# EAGLE design I2C_2_USB (EAGLE 7.7.0)
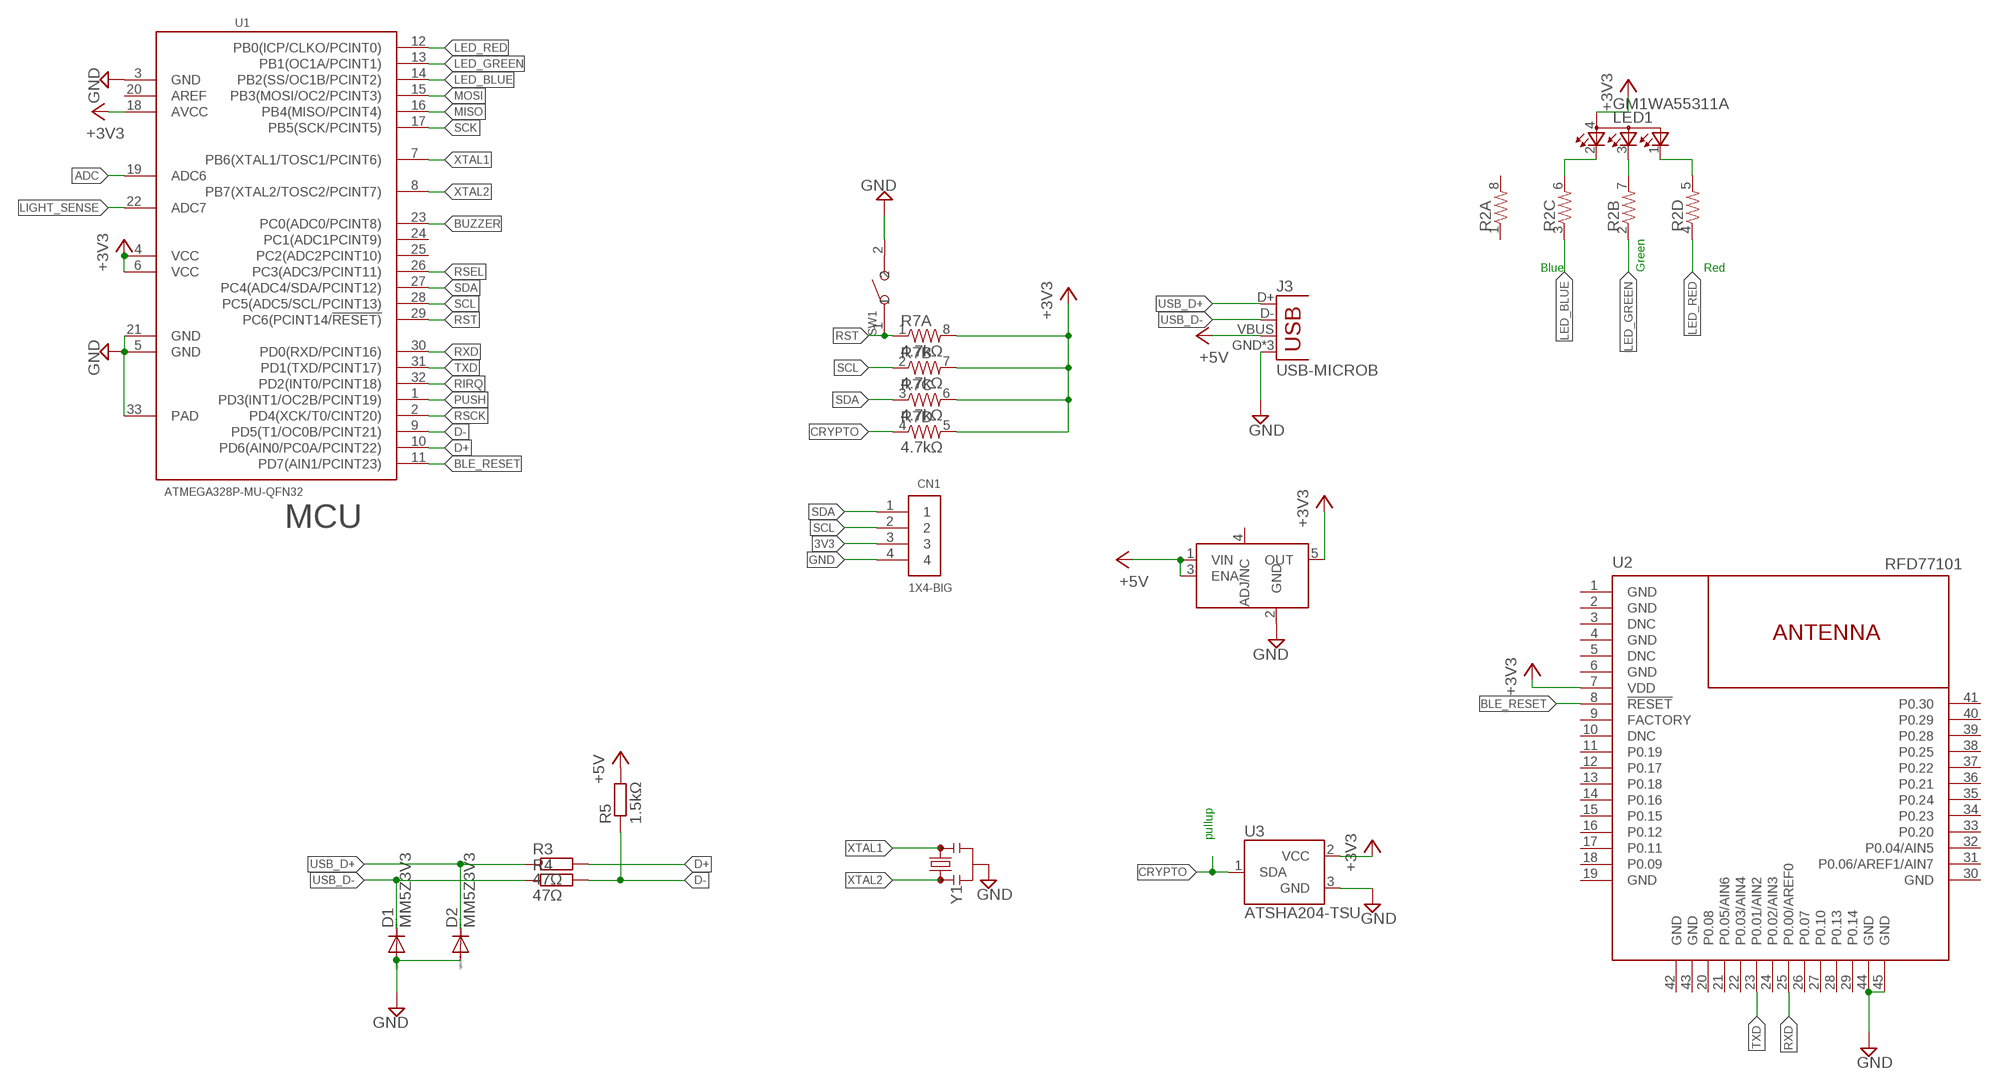
[diagram p0: schematic, sheet 1]

## Parts
CN1  1X4-BIG  [1X04-BIG]
D1  MM5Z3V3  DIODE-SOD523  [SOD523]
D2  MM5Z3V3  DIODE-SOD523  [SOD523]
J3  USB-MICROB  [USB-MICROB]
LED1  GM1WA55311A  [GM1WA55311A]
R2  RESISTOR-ARRAY0603-ARV  [0603-ARV]
R3  47Ω  R-EU_R0603  [R0603]
R4  47Ω  R-EU_R0603  [R0603]
R5  1.5kΩ  R-EU_R0603  [R0603]
R7  4.7kΩ  RESISTOR-ARRAY0603-ARV  [0603-ARV]
SW1  SMD-BUTTON(2P-6.0X3.0X2.5MM)-DHT-1163S  [SW2-4.0-6.0X3.0X2.5MM]
U1  ATMEGA328P-MU-QFN32  MCU-ATMEGA328P-MU(QFN32)  [QFN32G-0.5-5X5MM]
U2  RFD77101  [RFD77101]
U3  ATSHA204-TSU  [SOT23-3]
U$4  LDCL015  [SOT23-5]
Y1  RESONATORSMD-3.2X1.3  [RESONATOR-SMD-3.2X1.3]

## Nets
3V3: CN1.3
+3V3: LED1.4(A) R7.5 R7.6 R7.7 R7.8 U1.4(VCC) U1.6(VCC) U1.18(AVCC) U2.7(VDD) U3.2(VCC) U$4.5(OUT)
+5V: J3.VBUS R5.2 U$4.1(VIN) U$4.3(ENA)
ADC: U1.19(ADC6)
BLE_RESET: U1.11(PD7(AIN1/PCINT23)) U2.8(!RESET!)
BLUE: LED1.2(CRED) R2.6
BUZZER: U1.23(PC0(ADC0/PCINT8))
CRYPTO: R7.4 U3.1(SDA)
D+: R3.2 U1.10(PD6(AIN0/PC0A/PCINT22))
D-: R4.2 R5.1 U1.9(PD5(T1/OC0B/PCINT21))
GND: CN1.4 D1.A D2.A J3.GND J3.MT1(GND) J3.MT2(GND) SW1.2 U1.3(GND) U1.5(GND) U1.21(GND) U1.33(PAD) U2.44(GND) U2.45(GND) U3.3(GND) U$4.2(GND) Y1.2
GREEN: LED1.3(CBLUE) R2.7
LED_BLUE: R2.3 U1.14(PB2(SS/OC1B/PCINT2))
LED_GREEN: R2.2 U1.13(PB1(OC1A/PCINT1))
LED_RED: R2.4 U1.12(PB0(ICP/CLKO/PCINT0))
LIGHT_SENSE: U1.22(ADC7)
MISO: U1.16(PB4(MISO/PCINT4))
MOSI: U1.15(PB3(MOSI/OC2/PCINT3))
PUSH: U1.1(PD3(INT1/OC2B/PCINT19))
RED: LED1.1(CGREEN) R2.5
RIRQ: U1.32(PD2(INT0/PCINT18))
RSCK: U1.2(PD4(XCK/T0/CINT20))
RSEL: U1.26(PC3(ADC3/PCINT11))
RST: R7.1 SW1.1 U1.29(PC6(PCINT14/!RESET))
RXD: U1.30(PD0(RXD/PCINT16)) U2.25(P0.00/AREF0)
SCK: U1.17(PB5(SCK/PCINT5))
SCL: CN1.2 R7.2 U1.28(PC5(ADC5/SCL/PCINT13))
SDA: CN1.1 R7.3 U1.27(PC4(ADC4/SDA/PCINT12))
TXD: U1.31(PD1(TXD/PCINT17)) U2.23(P0.01/AIN2)
USB_D+: D2.C J3.D+ R3.1
USB_D-: D1.C J3.D- R4.1
XTAL1: U1.7(PB6(XTAL1/TOSC1/PCINT6)) Y1.3
XTAL2: U1.8(PB7(XTAL2/TOSC2/PCINT7)) Y1.1
Unconnected: R2.1 R2.8 U1.20(AREF) U1.24(PC1(ADC1PCINT9)) U1.25(PC2(ADC2PCINT10)) U2.3(DNC) U2.5(DNC) U2.9(FACTORY) U2.10(DNC) U2.11(P0.19) U2.12(P0.17) U2.13(P0.18) U2.14(P0.16) U2.15(P0.15) U2.16(P0.12) U2.17(P0.11) U2.18(P0.09) U2.20(P0.08) U2.21(P0.05/AIN6) U2.22(P0.03/AIN4) U2.24(P0.02/AIN3) U2.26(P0.07) U2.27(P0.10) U2.28(P0.13) U2.29(P0.14) U2.31(P0.06/AREF1/AIN7) U2.32(P0.04/AIN5) U2.33(P0.20) U2.34(P0.23) U2.35(P0.24) U2.36(P0.21) U2.37(P0.22) U2.38(P0.25) U2.39(P0.28) U2.40(P0.29) U2.41(P0.30) U$4.4(ADJ/NC)

## Notes on the sheet
- Blue | Green | Red
- MCU
- pullup

## Power pins joined to a net without a drawn wire
GND: U2.1(GND) U2.2(GND) U2.4(GND) U2.6(GND) U2.19(GND) U2.30(GND) U2.42(GND) U2.43(GND)

## Library data of the parts
CN1 = adafruit:1X4: 4-pin connector
D1 D2 = diode:DIODE-: DIODE
J3 = SparkFun-Retired:USB: USB Connectors USB-B-PTH is fully proven SKU : PRT-00139/CONN-08278 USB-miniB is fully proven SKU : PRT-00587 USB-A-PCB is untested. USB-A-H is throughly reviewed, but untested. Spark Fun Electronics SKU : PRT-00437 USB-B-SMT is throughly reviewed, but untested. Needs silkscreen touching up. USB-A-S has not been used/tested USB-MB-H has not been used/tested USB-MICROB has been used. CONN-09505; PROD_ID: CONN-09505
LED1 = led:GM1WA55311A: Chip LED RGB Source: http://document.sharpsma.com/files/GM1WA55311A_SS.pdf
R2 R7 = SparkFun:RESISTOR-ARRAY: Array Chip Resistor Source: RS Component / Phycomp
R3-R5 = rcl:R-EU_: RESISTOR, European symbol
SW1 = Seeed-OPL-Switch:SMD-BUTTON(2P-6.0X3.0X2.5MM): 311020029
U1 = Seeed-OPL-ic:MCU-ATMEGA328P-MU(QFN32): 310010005; MPN: ATMEGA328P-MU
U2 = SparkFun-RF:RFD77101: Simblee  BLE Module RFD77101 © 2015 RF Digital Corporation Datasheet <https://cdn.sparkfun.com/datasheets/IoT/Simblee%20RFD77101%20Datasheet%20v1.0.pdf> PATENTS PENDING 04.01.2015 Bluetooth Smart radio transceiver, ARM Cortex M0 microcontroller. 128kB Flash, 24kB RAM, no EEPROM Arduino-compatible. SparkFun Products: Simblee BLE Module - RFD77101 <https://www.sparkfun.com/products/13808> SparkFun Simblee BLE Breakout - RFD77101 <https://www.sparkfun.com/products/13632>; PROD_ID: COMP-13237; SF_ID: WRL-13808
U3 = SparkFun-IC-Special-Function:ATSHA204: Atmel ATSHA204 The Atmel ATSHA204 is an optimized authentication chip that includes a 4.5Kb EEPROM. This array can be used for storage of keys, miscellaneous read/write, read-only, password or secret data, and consumption tracking. Access to the various sections of memory can be restricted in a variety of ways and then the configuration locked to prevent changes. Datasheet <http://www.atmel.com/Images/Atmel-8740-CryptoAuth-ATSHA204-Datasheet.pdf> SparkFun Products SparkFun Electric Imp Shield <https://www.sparkfun.com/products/12887> SparkFun Electric Imp Breakout <https://www.sparkfun.com/products/12886>; PROD_ID: IC-11208
U$4 = LDCL015:LDCL015
Y1 = SparkFun-Clocks:RESONATOR: Resonators (Generic) Ceramic resonators are clock-generating components, often used to control timing in microcontrollers. They usually have 3 pins: two pins for oscillation, and one pin for ground. Compared to crystals, resonators have worse tolerance, but are usually much cheaper. Plus, they have built-in load capacitors! These devices are used on boards like the Arduino Pro 8MHz <https://www.sparkfun.com/products/11114> and Arduino Pro 16MHz <https://www.sparkfun.com/products/11113>.

## Board
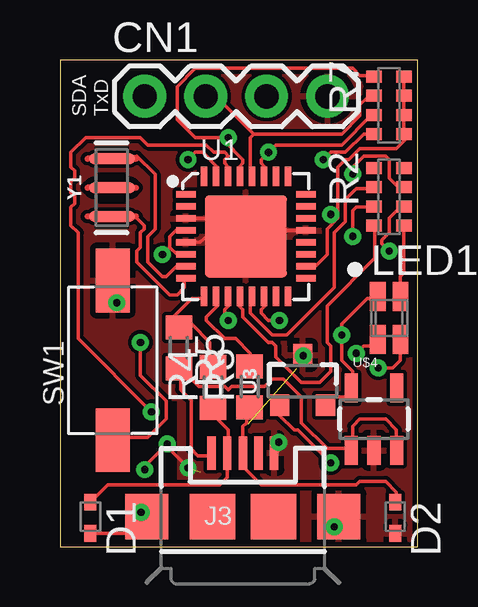
[diagram p1: board, top side]
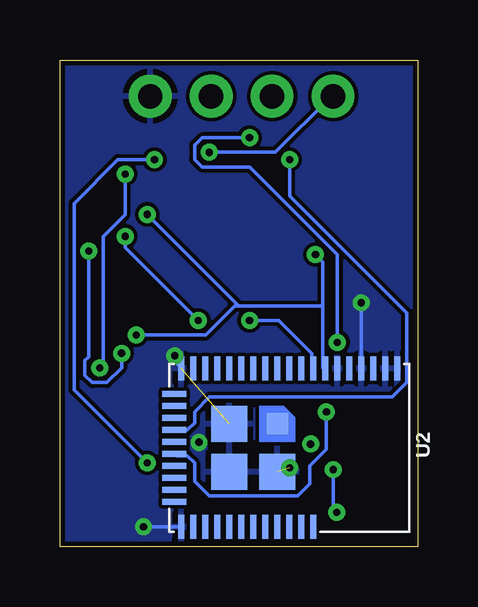
[diagram p2: board, bottom side, seen from below]

Size 14.91 x 20.31 mm. Coordinates in mm from the lower left corner, seen from the top.
Outline: 0,0 14.91,0 14.91,20.31 0,20.31 0,0
Copper layers (1*16): Top 0.035mm / dielectric 1.5mm / Bottom 0.035mm
Design rules "default": minimum track width 6mil, minimum drill 0.3mm, track to track 6mil, track to pad 6mil, pad to pad 6mil, via to via 6mil, smd to smd 6mil, copper to edge 8mil, drill to drill 8mil, minimum pad ring 10mil, minimum via ring 8mil, stop-mask expansion 4mil, vias tented up to drill 0mil, thermal gap 10mil

### Footprints (pad centres in the part's own frame; a part is rotated, then mirrored left to right if it is on the bottom)
1X04-BIG = drill 1.016 pad 1.778: 1 0,0; 2 2.54,0; 3 5.08,0; 4 7.62,0
SOD523 = smd 0.7 x 0.5: A 0.7,0; C -0.6,0
USB-MICROB = smd 0.35 x 1.4: D+ 0,2.65; D- -0.65,2.65; GND 1.3,2.65; ID 0.65,2.65; VBUS -1.3,2.65 | smd 1.8 x 1.9: MT1 -4,0; MT2 4,0 | smd 1.9 x 1.9: P$1 -1.27,0; P$2 1.27,0
GM1WA55311A = smd 0.65 x 1.2: 1 0.477,0.9; 2 -0.475,-0.9; 3 0.475,-0.9; 4 -0.477,0.9
0603-ARV = smd 0.5 x 0.65: 1 -1.2,-0.625; 2 -0.4,-0.625; 3 0.4,-0.625; 4 1.2,-0.625; 5 1.2,0.625; 6 0.4,0.625; 7 -0.4,0.625; 8 -1.2,0.625
R0603 = smd 1 x 1.1: 1 -0.85,0; 2 0.85,0
SW2-4.0-6.0X3.0X2.5MM = smd 2.65 x 1.4: 1 -3.325,0; 2 3.325,0
QFN32G-0.5-5X5MM = smd 0.813 x 0.279: 1 -2.5,1.75; 2 -2.5,1.25; 3 -2.5,0.75; 4 -2.5,0.25; 5 -2.5,-0.25; 6 -2.5,-0.75; 7 -2.5,-1.25; 8 -2.5,-1.75; 17 2.5,-1.75; 18 2.5,-1.25; 19 2.5,-0.75; 20 2.5,-0.25; 21 2.5,0.25; 22 2.5,0.75; 23 2.5,1.25; 24 2.5,1.75 | smd 0.279 x 0.813: 9 -1.75,-2.5; 10 -1.25,-2.5; 11 -0.75,-2.5; 12 -0.25,-2.5; 13 0.25,-2.5; 14 0.75,-2.5; 15 1.25,-2.5; 16 1.75,-2.5; 25 1.75,2.5; 26 1.25,2.5; 27 0.75,2.5; 28 0.25,2.5; 29 -0.25,2.5; 30 -0.75,2.5; 31 -1.25,2.5; 32 -1.75,2.5 | smd 3.429 x 3.429: 33 0,0
RFD77101 = smd 1 x 0.254: 1 0,0; 2 0,-0.5; 3 0,-1; 4 0,-1.5; 5 0,-2; 6 0,-2.5; 7 0,-3; 8 0,-3.5; 9 0,-4; 10 0,-4.5; 11 0,-5; 12 0,-5.5; 13 0,-6; 14 0,-6.5; 15 0,-7; 16 0,-7.5; 17 0,-8; 18 0,-8.5; 19 0,-9; 30 6.61,-9; 31 6.61,-8.5; 32 6.61,-8; 33 6.61,-7.5; 34 6.61,-7; 35 6.61,-6.5; 36 6.61,-6; 37 6.61,-5.5; 38 6.61,-5; 39 6.61,-4.5; 40 6.61,-4; 41 6.61,-3.5 | smd 0.254 x 1: 20 1.055,-9.29; 21 1.555,-9.29; 22 2.055,-9.29; 23 2.555,-9.29; 24 3.055,-9.29; 25 3.555,-9.29; 26 4.055,-9.29; 27 4.555,-9.29; 28 5.055,-9.29; 29 5.555,-9.29 | smd 0.9 x 0.9: 42 2.3,-4.99 | smd 1.5 x 1.5: 43 2.3,-6.99; 44 4.3,-6.99; 45 4.3,-4.99
SOT23-3 = smd 0.8 x 0.9: 1 -0.95,-1; 2 0.95,-1; 3 0,1.1
SOT23-5 = smd 0.55 x 1.2: 1 -0.95,-1.3; 2 0,-1.3; 3 0.95,-1.3; 4 0.95,1.3; 5 -0.95,1.3
RESONATOR-SMD-3.2X1.3 = smd 0.45 x 1.905: 1 -1.2,0; 2 0,0; 3 1.2,0

### Placement (x,y rotation side)
CN1  3.53,18.8 0 top
D1  1.27,1.27 270 top
D2  13.97,1.27 270 top
J3  7.62,1.27 0 top
LED1  13.72,9.55 0 top
R2  13.72,14.61 270 top
R3  7.9,6.68 90 top
R4  6.38,6.65 90 top
R5  4.95,8.31 270 top
R7  13.72,18.41 270 top
SW1  2.2,7.79 90 top
U1  7.75,12.95 0 top
U2  0.86,7.44 270 bottom
U3  10.11,6.91 0 top
U$4  13.08,5.33 0 top
Y1  2.16,14.99 90 top

### Tracks (layer width: path | path; a pad name or v marks a point on that pad's centre or on a via)
+3V3  (via drill 0.3)
  Top 0.152: R7.8 14.33,19.51 14.33,18.9 R7.7 14.33,18.75 14.33,18.14 R7.6 14.33,17.98 14.33,17.22 R7.5 14.48,17.07 14.02,16.61 12.5,16.61 12.04,16.15 11.89,16.15 11.58,15.85 11.58,13.87 | 11.58,13.87 11.58,13.72 11.12,13.26 11.12,12.19 10.67,11.73 10.36,11.73 U1.18 | 4.57,12.5 4.88,12.19 5.18,12.19 U1.6 | 4.57,12.5 4.57,12.95 4.88,13.26 5.18,13.26 U1.4 | 4.57,12.5 v4.27,12.19 | U3.2 11.12,5.94 11.43,6.25 11.89,6.25 12.19,6.55 U$4.5 12.19,6.71 12.19,7.32 11.73,7.77 v11.73,8.84 11.73,9.3 12.8,10.36 13.11,10.36 LED1.4 | v11.28,13.87 11.58,13.87
  Bottom 0.152: 3.96,10.06 3.96,11.89 v4.27,12.19 | 3.96,10.06 3.96,7.47 U2.7 | 7.47,10.06 7.62,10.06 8.84,8.84 v11.73,8.84 | 7.47,10.06 3.96,10.06 | 7.47,10.06 v11.28,13.87
+5V
  Top 0.152: U$4.3 14.02,4.12 14.02,4.88 13.56,5.33 12.5,5.33 12.19,5.03 12.19,4.12 U$4.1 12.04,4.12 11.12,4.12 10.06,5.18 10.06,6.25 9.3,7.01 8.84,7.01 8.53,6.71 7.16,6.71 7.01,6.55 6.86,6.71 5.79,6.71 5.03,7.47 R5.2 5.03,7.32 5.03,6.55 5.46,6.12 5.46,4.09 5.74,3.81 6.38,3.81 6.4,4.12 6.4,3.96 J3.VBUS
BLE_RESET  (via drill 0.3)
  Top 0.152: v7.01,9.45 7.01,9.6 6.86,9.75 6.86,9.91 7.01,10.06 7.01,10.36 U1.11
  Bottom 0.152: v7.01,9.45 5.79,9.45 4.42,8.08 4.42,7.47 U2.8
BLUE  (via drill 0.3)
  Top 0.152: v13.72,12.34 13.41,12.65 13.41,12.8 13.72,13.11 13.72,13.72 14.17,14.17 14.33,14.17 R2.6 | v12.34,8.08 12.65,8.38 13.11,8.38 13.26,8.53 LED1.2
  Bottom 0.152: v13.72,12.34 13.72,7.92 13.87,7.77 13.87,7.16 13.56,6.86 12.95,6.86 12.34,7.47 v12.34,8.08
CRYPTO  (via drill 0.3)
  Top 0.152: v10.97,16.15 11.28,16.46 11.89,16.46 12.65,17.22 12.95,17.22 R7.4 | v11.28,3.5 9.91,4.88 9.75,4.88 9.14,5.49 9.14,5.79 U3.1
  Bottom 0.152: v10.97,16.15 12.5,16.15 14.33,14.33 14.33,6.55 v11.28,3.5
D+
  Top 0.152: U1.10 6.55,10.36 6.55,10.06 6.1,9.6 6.1,9.45 6.86,8.69 7.32,8.69 7.92,8.08 7.92,7.62 R3.2
D-
  Top 0.152: U1.9 5.94,10.36 5.49,10.36 4.72,9.6 4.72,9.45 4.88,9.3 R5.1 5.03,9.3 5.49,9.3 6.25,8.53 6.25,7.62 R4.2
GND  (via drill 0.3)  (2 unrouted)
  Top 0.152: U1.33 6.15,12.98 5.84,12.72 5.38,12.72 U1.5 | 2.46,9.98 2.46,10.19 v2.36,10.19 2.2,10.19 SW1.2 | U1.3 7.75,13.7 U1.33 | U1.21 7.75,13.2 U1.33 | v11.43,0.84 11.38,1.03 J3.MT2 | v10.13,7.98 10.14,7.9 U3.3 | v9.12,4.37 9.09,4.02 J3.GND | D1.A 3.62,0.57 J3.MT1 3.38,1.27 v3.38,1.45 | v3.53,3.23 3.53,3.35 v4.47,4.29 4.47,4.17 v5.33,3.3
  Bottom 0.152: U2.4 v2.36,10.19 | U2.30 10.67,0.83 v11.43,0.84 | U2.19 10.11,7.75 v10.13,7.98 | v3.38,1.45 3.53,1.45 v3.53,3.23
  pour Top: 14.99,0 14.99,20.32 0,20.32 0.08,6.35 0.08,6.15 4.95,6.15 4.95,0.18 5.13,0
  pour Bottom: 14.86,0 14.86,20.32 0,20.32 0.03,6.25 4.93,6.12 5.08,-0.03
GREEN  (via drill 0.3)
  Top 0.152: v12.19,15.54 12.19,15.85 12.65,16.31 13.56,16.31 13.72,16.15 13.72,15.39 14.02,15.09 14.33,15.09 R2.7 | v13.26,7.47 13.87,7.47 14.17,7.77 14.17,8.53 LED1.3
  Bottom 0.152: v12.19,15.54 12.19,13.87 13.11,12.95 13.11,7.62 v13.26,7.47
LED_BLUE  (via drill 0.3)
  Top 0.152: v12.19,12.95 12.19,14.02 12.34,14.17 12.95,14.17 R2.3 | v9.14,9.45 8.69,9.45 8.38,9.75 8.38,9.91 8.53,10.06 8.53,10.36 U1.14
  Bottom 0.152: v12.19,12.95 12.19,12.5 v9.14,9.45
LED_GREEN
  Top 0.152: R2.2 12.95,14.94 12.34,14.94 11.89,14.48 11.89,13.56 11.43,13.11 11.43,10.82 9.45,8.84 8.84,8.84 7.92,9.75 7.92,10.36 U1.13
LED_RED
  Top 0.152: R2.4 13.11,13.26 13.11,12.04 11.12,10.06 11.12,8.53 11.28,8.38 11.28,7.32 10.82,6.86 10.06,6.86 8.99,7.92 8.99,8.38 8.84,8.53 8.69,8.53 7.62,9.6 7.62,9.91 7.47,10.06 7.47,10.36 U1.12
RED
  Top 0.152: R2.5 14.33,13.26 14.33,11.43 14.17,11.28 14.17,10.52 LED1.1
RST  (via drill 0.3)
  Top 0.152: 6.86,16.92 7.62,16.15 7.62,16 7.47,15.85 7.47,15.54 U1.29 | 6.86,16.92 6.71,17.07 5.64,17.07 4.88,17.83 4.88,19.2 5.64,19.96 12.19,19.96 12.5,19.66 12.95,19.66 R7.1 | v3.35,8.53 3.35,7.16 4.42,6.1 4.42,5.33 3.66,4.57 2.29,4.57 SW1.1 | 6.86,16.92 v7.01,17.07
  Bottom 0.152: v3.35,8.53 3.35,12.19 7.01,15.85 8.99,15.85 9.3,16.15 9.3,16.76 8.99,17.07 v7.01,17.07
RXD  (via drill 0.3)
  Top 0.152: v3.81,5.64 0.76,8.69 0.76,13.11 0.46,13.41 0.46,14.17 0.61,14.33 0.61,14.63 0.46,14.78 0.46,15.24 0.61,15.39 0.61,15.7 0.46,15.85 0.46,16.46 1.07,17.07 3.35,17.07 3.66,16.76 6.1,16.76 6.4,16.46 6.86,16.46 7.01,16.31 6.86,16.15 6.86,16 7.01,15.85 7.01,15.54 U1.30
  Bottom 0.152: U2.25 10.06,3.81 9.6,3.81 9.3,3.5 9.3,2.74 8.69,2.13 5,2.13 4.5,2.64 4.5,3.38 3.81,4.06 v3.81,5.64
SCL
  Top 0.152: 8.08,17.22 11.73,17.22 12.5,17.98 12.5,18.44 12.8,18.75 12.95,18.75 R7.2 | 8.08,17.22 6.55,18.75 6.1,18.75 CN1.2 | 8.08,17.22 7.92,17.07 7.92,15.54 U1.28
SDA  (via drill 0.3)
  Top 0.152: R7.3 12.95,17.98 11.73,16.76 8.99,16.76 v8.69,16.46 8.38,16.15 8.38,16 8.53,15.85 8.53,15.54 U1.27
  Bottom 0.152: v8.69,16.46 5.94,16.46 3.66,18.75 CN1.1
TXD  (via drill 0.3)
  Top 0.152: v5.33,16.15 5.64,16.46 5.94,16.46 6.55,15.85 6.55,15.54 U1.31
  Bottom 0.152: v5.33,16.15 5.33,14.63 0.46,9.75 0.46,6.86 1.07,6.25 8.69,6.25 9.3,5.64 9.3,5.18 9.6,4.88 10.06,4.88 U2.23
USB_D+
  Top 0.152: D2.C 14.02,1.98 14.02,2.29 13.56,2.74 12.5,2.74 12.34,2.59 8.38,2.59 7.62,3.35 J3.D+ 7.62,5.03 7.77,5.18 7.77,5.79 R3.1
USB_D-
  Top 0.152: R4.1 6.4,5.79 6.4,5.49 7.01,4.88 7.01,3.96 J3.D- 6.97,2.91 6.66,2.59 1.99,2.59 D1.C
XTAL1
  Top 0.152: U1.7 5.18,11.73 4.88,11.73 4.42,11.28 4.27,11.28 3.66,11.89 3.66,12.95 3.96,13.26 3.96,15.54 3.2,16.31 Y1.3
XTAL2
  Top 0.152: U1.8 5.18,11.12 5.18,10.82 4.88,10.52 4.57,10.52 3.2,11.89 3.2,12.34 3.35,12.5 3.35,13.11 3.5,13.26 3.5,13.41 3.2,13.72 Y1.1

### Text on the board
tPlace: Connect BLE Reset | SDA / TxD
bPlace: Mihai Galos | 01/2018 | 3V3 | GND | SDA / TxD | SCL / RxD | I2C to USB v0.1.1